# Altium schematic sheet Diagrama en bloques.SchDoc
size A4; DocumentNumber: 1; SheetNumber: 1; SheetTotal: 5
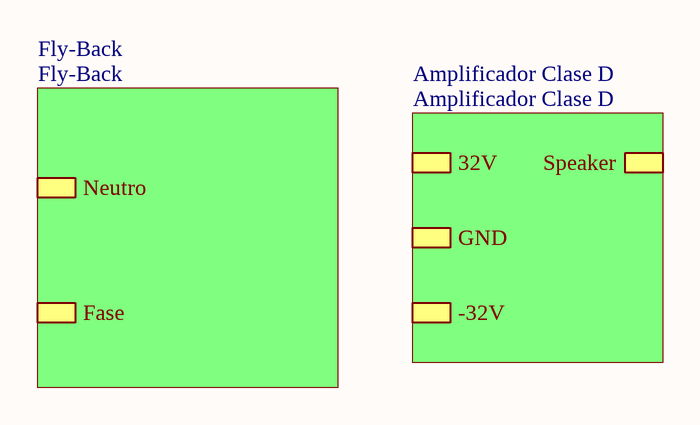
[diagram p0: Diagrama en bloques.SchDoc]

## Sub-sheets
Amplificador Clase D = Amplificador Clase D: Speaker, 32V, GND, -32V
Fly-Back = Fly-Back: Fase, Neutro